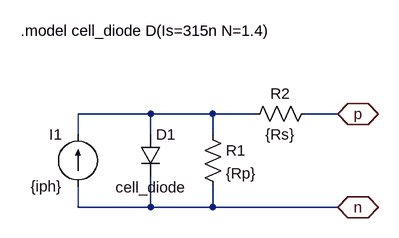
[diagram p0: schematic pv.asc]
pv.asc, the LTspice schematic file:
Version 4.1
SHEET 1 880 680
WIRE 112 32 0 32
WIRE 208 32 112 32
WIRE 272 32 208 32
WIRE 400 32 352 32
WIRE 0 64 0 32
WIRE 112 64 112 32
WIRE 208 64 208 32
WIRE 0 176 0 144
WIRE 112 176 112 128
WIRE 112 176 0 176
WIRE 208 176 208 144
WIRE 208 176 112 176
WIRE 400 176 208 176
FLAG 400 32 p
IOPIN 400 32 BiDir
FLAG 400 176 n
IOPIN 400 176 BiDir
SYMBOL diode 96 64 R0
WINDOW 3 -38 81 Left 2
SYMATTR Value cell_diode
SYMATTR InstName D1
SYMBOL res 192 48 R0
SYMATTR InstName R1
SYMATTR Value {Rp}
SYMBOL res 368 16 R90
WINDOW 0 0 56 VBottom 2
WINDOW 3 32 56 VTop 2
SYMATTR InstName R2
SYMATTR Value {Rs}
SYMBOL current 0 144 R180
WINDOW 0 24 80 Left 2
WINDOW 3 24 0 Left 2
WINDOW 123 0 0 Left 0
WINDOW 39 0 0 Left 0
SYMATTR InstName I1
SYMATTR Value {iph}
TEXT -88 -96 Left 2 !.model cell_diode D(Is=315n N=1.4)

The netlist it stands for:
* pv.asc
D1 N001 n cell_diode
R1 N001 n {Rp}
R2 p N001 {Rs}
I1 n N001 {iph}
.model D D
.lib standard.dio
.model cell_diode D(Is=315n N=1.4)
.backanno
.end